# Altium schematic sheet ADC.SchDoc
size A4; SheetNumber: 5; SheetTotal: 14
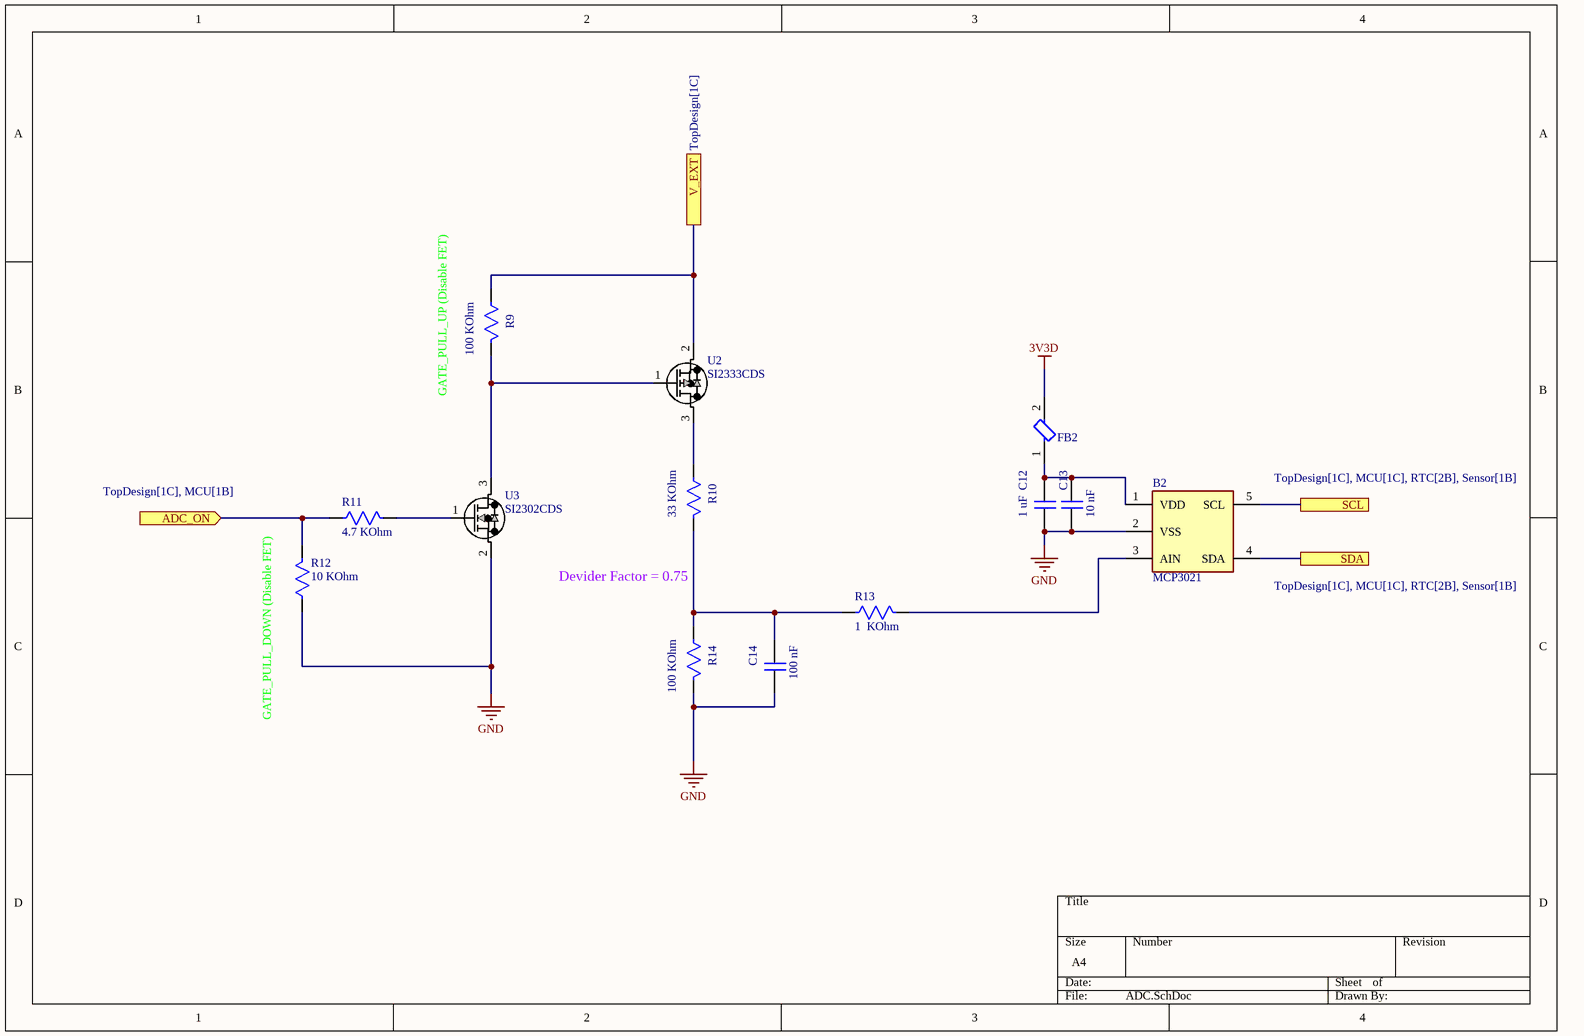
[diagram p0: ADC.SchDoc]

## Parts
B2  MCP3021  [MCP3021A5T-E_OT]
C12  1 uF  [CAP_0603]
C13  10 nF  [CAP_0603]
C14  100 nF  [CAP_0603]
FB2  BLM18KG601SN1D  [FBead_Murata_BLM18KG601SN1D]  (value not drawn)
R9  100 KOhm  [Res_0603]
R10  33 KOhm  [Res_0603]
R11  4.7 KOhm  [Res_0603]
R12  10 KOhm  [Res_0603]
R13  1  KOhm  [Res_0603]
R14  100 KOhm  [Res_0603]
U2  SI2333CDS  [SOT-23]
U3  SI2302CDS  [SOT-23]

## Ports
ADC_ON (in, see TopDesign[1C], MCU[1B]), SCL (see TopDesign[1C], MCU[1C], RTC[2B], Sensor[1B]), SDA (see TopDesign[1C], MCU[1C], RTC[2B], Sensor[1B]), V_EXT (see TopDesign[1C])

## Nets
3V3D: FB2.2
GND: B2.2(VSS) C12.1 C13.1 C14.1 R12.2 R14.1 U3.2(S)
ADC_ON: R11.2 R12.1 ; port ADC_ON
SCL: B2.5(SCL) ; port SCL
SDA: B2.4(SDA) ; port SDA
V_EXT: R9.2 U2.2(S) ; port V_EXT
NetB2_1: B2.1(VDD) C12.2 C13.2 FB2.1
NetB2_3: B2.3(AIN) R13.1
NetC14_2: C14.2 R10.1 R13.2 R14.2
NetR9_1: R9.1 U2.1(G) U3.3(D)
NetR10_2: R10.2 U2.3(D)
NetR11_1: R11.1 U3.1(G)

## Notes on the sheet
- (near R9) GATE_PULL_UP (Disable FET)
- Devider Factor = 0.75
- (near R12) GATE_PULL_DOWN (Disable FET)

## Library data of the parts
B2 = MCP3021A5T-E_OT: ADC - ,SAR, Single Ended ,10-bit ,I2C , 250uA-Active ,1uA -Standby; Manufacturer_Name: Microchip; Manufacturer_Part_Number: MCP3021A5T-E/OT; Geometry.Height: 1.45mm; Foot Print: SOT-23-5; Datasheet Link: https://lcsc.componentsearchengine.com/Datasheets/2/MCP3021A5T-E_OT.pdf; LCSC: C128576
C12-C14 = Cap SMD: Cap SMD.
R9-R14 = Res smd: SMD Resistor; MP: RC0805FR-07330RL; MF: Yageo; Package: 2012 Rohm Semiconductor; Value: *; SnapEDA_Link: https://www.snapeda.com/parts/RC0805FR-07330RL/Yageo/view-part/106115/?ref=snap; Price: None; Availability: Unavailable
U2 = SI2333CDS: P-Channel  MOSFET Vds=12V ,RDS(on)=35mOhm .  at VGS = 4.5 V; Mfr_Name: Vishay; Type: P-MOSFET; LCSC: C48179
U3 = SI2302CDS: N-Channel  MOSFET Vds=20V ,RDS(on)=57mOhm .  at VGS = 4.5 V; Mfr_Name: Vishay; Type: N-MOSFET; LCSC: C10488